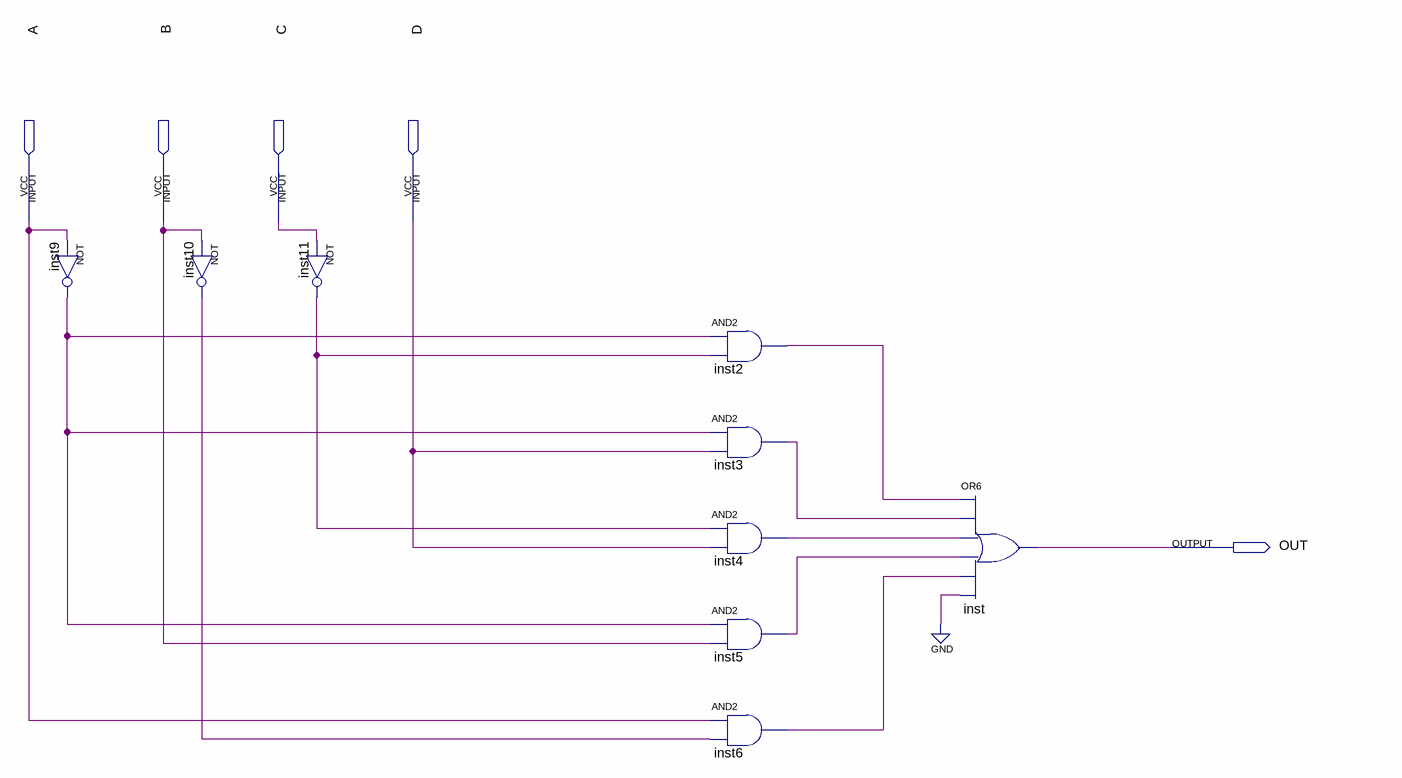
[diagram p0: schematic sheet]
// Quartus schematic ledC.bdf as structural Verilog: 9 symbols, 5 pins
module ledC (
  input  A,
  input  B,
  input  C,
  input  D,
  output OUT
);

  wire inst2_out, inst3_out, inst4_out, inst5_out, inst6_out, inst9_out, inst10_out, inst11_out;

  not inst9 (inst9_out, A);
  not inst10 (inst10_out, B);
  not inst11 (inst11_out, C);
  and inst2 (inst2_out, inst9_out, inst11_out);
  and inst3 (inst3_out, inst9_out, D);
  and inst4 (inst4_out, inst11_out, D);
  and inst5 (inst5_out, inst9_out, B);
  and inst6 (inst6_out, A, inst10_out);
  or inst (OUT, inst2_out, inst3_out, inst4_out, inst5_out, inst6_out, 1'b0);
endmodule
